# EAGLE design univ_3-rev1 (EAGLE 5.11)
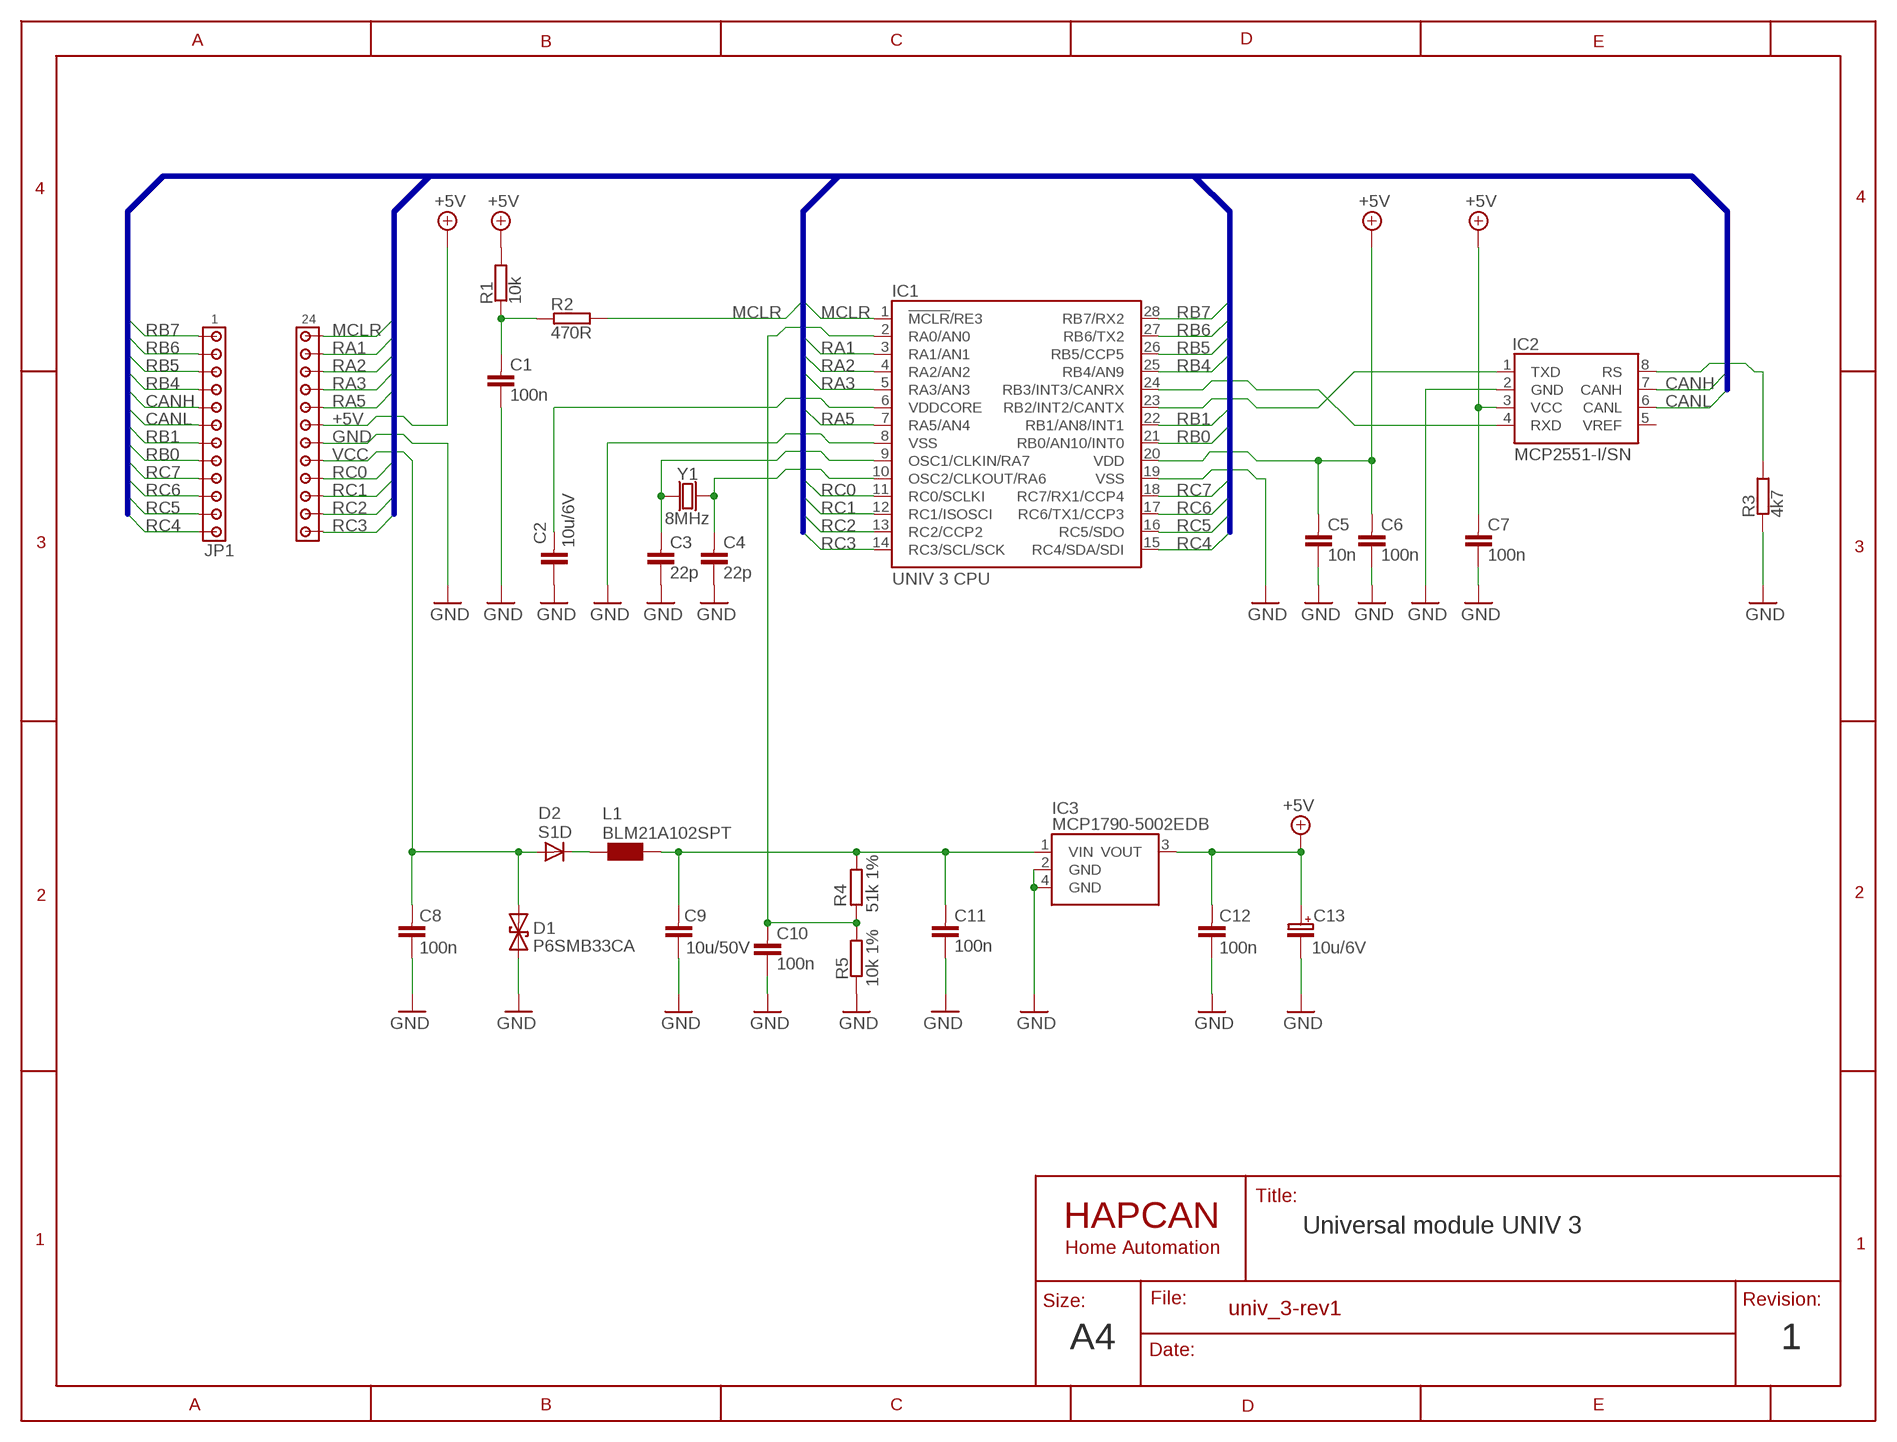
[diagram p0: schematic, sheet 1]

## Parts
C1  100n  CAPACITOR0805  [0805]
C2  10u/6V  CAPACITOR0805  [0805]
C3  22p  CAPACITOR0805  [0805]
C4  22p  CAPACITOR0805  [0805]
C5  10n  CAPACITOR0805  [0805]
C6  100n  CAPACITOR0805  [0805]
C7  100n  CAPACITOR0805  [0805]
C8  100n  CAPACITOR0805  [0805]
C9  10u/50V  CAPACITOR1210  [1210]
C10  100n  CAPACITOR0805  [0805]
C11  100n  CAPACITOR0805  [0805]
C12  100n  CAPACITOR0805  [0805]
C13  10u/6V  CAPACITOR-POLARIZED-SMC_B  [SMC_B]
D1  P6SMB33CA  DIODE_TRANSIL  [DO-214@1]
D2  S1D  DIODEDO-214  [DO-214]
IC1  UNIV 3 CPU  UNIV3(CPU)  [UNIV3CPU]
IC2  MCP2551-I/SN  MCP2551  [SO-08]
IC3  MCP1790-5002EDB  MCP1826SOT223-3  [SOT-223]
JP1  DIL-24  [DIL-24]
L1  BLM21A102SPT  BLMXXX  [0805]
R1  10k  RESISTOR  [0805]
R2  470R  RESISTOR  [0805]
R3  4k7  RESISTOR  [0805]
R4  51k 1%  RESISTOR  [0805]
R5  10k 1%  RESISTOR  [0805]
Y1  8MHz  CRYSTALHC49V  [CRYSTAL-HC49V]

## Nets
+5V: C5.1 C6.1 C7.1 C12.1 C13.+ IC1.20(VDD) IC2.3(VCC) IC3.3(VOUT) JP1.19 R1.2
CANH: IC2.7(CANH) JP1.5
CANL: IC2.6(CANL) JP1.6
GND: C1.2 C2.2 C3.2 C4.2 C5.2 C6.2 C7.2 C8.2 C9.2 C10.2 C11.2 C12.2 C13.- D1.A IC1.8(VSS) IC1.19(VSS) IC2.2(GND) IC3.2(GND) IC3.4(GND) JP1.18 R3.1 R5.1
MCLR: IC1.1(!MCLR!/RE3) JP1.24 R2.2
N$1: C10.1 IC1.2(RA0/AN0) R4.2 R5.2
N$2: IC1.24(RB3/INT3/CANRX) IC2.4(RXD)
N$4: C1.1 R1.1 R2.1
N$8: IC1.23(RB2/INT2/CANTX) IC2.1(TXD)
N$12: IC2.8(RS) R3.2
N$15: C4.1 IC1.10(OSC2/CLKOUT/RA6) Y1.2
N$17: C9.1 C11.1 IC3.1(VIN) L1.1 R4.1
N$40: C3.1 IC1.9(OSC1/CLKIN/RA7) Y1.1
N$56: C2.1 IC1.6(VDDCORE)
N$67: D2.C L1.2
RA1: IC1.3(RA1/AN1) JP1.23
RA2: IC1.4(RA2/AN2) JP1.22
RA3: IC1.5(RA3/AN3) JP1.21
RA5: IC1.7(RA5/AN4) JP1.20
RB0: IC1.21(RB0/AN10/INT0) JP1.8
RB1: IC1.22(RB1/AN8/INT1) JP1.7
RB4: IC1.25(RB4/AN9) JP1.4
RB5: IC1.26(RB5/CCP5) JP1.3
RB6: IC1.27(RB6/TX2) JP1.2
RB7: IC1.28(RB7/RX2) JP1.1
RC0: IC1.11(RC0/SCLKI) JP1.16
RC1: IC1.12(RC1/ISOSCI) JP1.15
RC2: IC1.13(RC2/CCP2) JP1.14
RC3: IC1.14(RC3/SCL/SCK) JP1.13
RC4: IC1.15(RC4/SDA/SDI) JP1.12
RC5: IC1.16(RC5/SDO) JP1.11
RC6: IC1.17(RC6/TX1/CCP3) JP1.10
RC7: IC1.18(RC7/RX1/CCP4) JP1.9
VCC: C8.1 D1.C D2.A JP1.17
Unconnected: IC2.5(VREF)

## Buses
RA[0..5],RB[0..7],RC[0..7],MCLR,CANL,CANH

## Notes on the sheet
- Universal module UNIV 3
- A4 | 1

## Library data of the parts
C1-C12 = HAPCAN_devices - UNIV3:CAPACITOR: HAPCAN Capacitor
C13 = HAPCAN_devices - UNIV3:CAPACITOR-POLARIZED: HAPCAN Polarazied Capacitor
D1 = HAPCAN_devices - UNIV3:DIODE_TRANSIL: Transil diode
D2 = HAPCAN_devices - UNIV3:DIODE: Diode
IC1 = HAPCAN_devices - UNIV3:UNIV3(CPU): HAPCAN Microcontroller UNIV 3 (CPU)
IC2 = HAPCAN_devices - UNIV3:MCP2551: HAPCAN CAN Tranceiver
IC3 = HAPCAN_devices - UNIV3:MCP1826: 1000 mA, Low Voltage, Low Quiescent Current LDO Regulator
JP1 = HAPCAN_devices - UNIV3:DIL-24: HAPCAN DIL-24
L1 = HAPCAN_devices - UNIV3:BLMXXX: Choke
R1-R5 = HAPCAN_devices - UNIV3:RESISTOR: HAPCAN Resistor
Y1 = HAPCAN_devices - UNIV3:CRYSTAL: HAPCAN Crystal

## Board
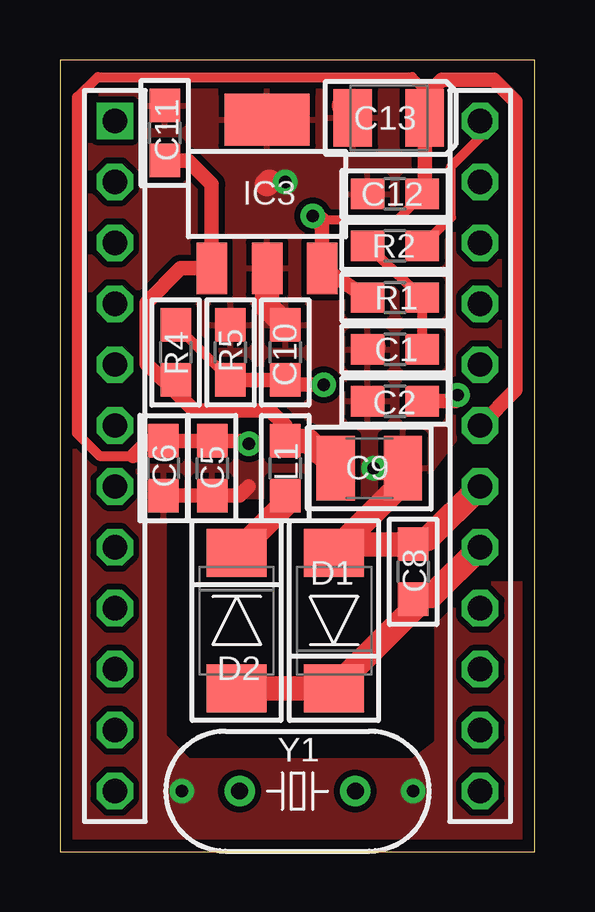
[diagram p1: board, top side]
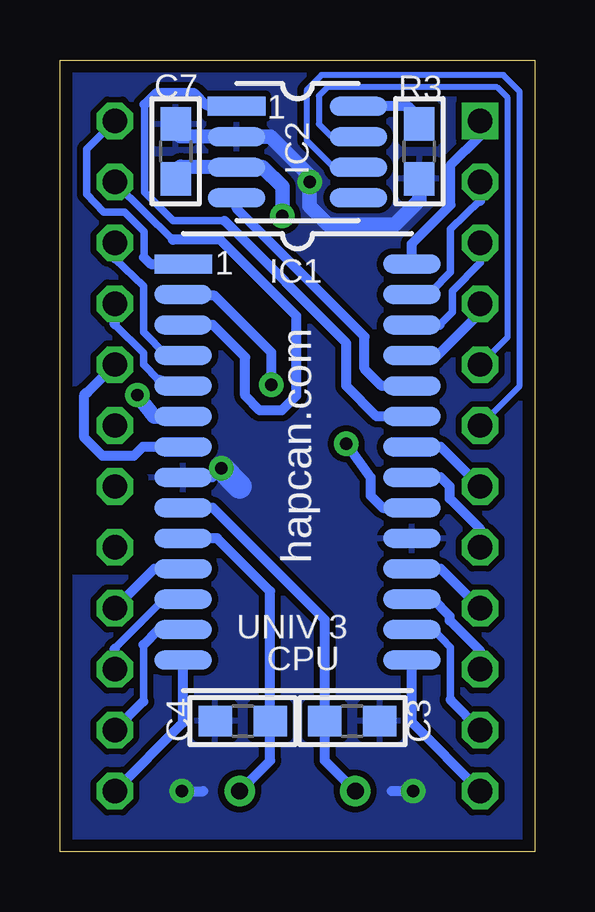
[diagram p2: board, bottom side, seen from below]

Size 19.81 x 33.02 mm. Coordinates in mm from the lower left corner, seen from the top.
Outline: 0,0 19.81,0 19.81,33.02 0,33.02 0,0
Copper layers (1*16): Top 0.035mm / dielectric 1.5mm / Bottom 0.035mm
Design rules "HAPCAN-Drc": minimum track width 10mil, minimum drill 0.5mm, track to track 10mil, track to pad 10mil, pad to pad 10mil, via to via 10mil, smd to smd 0mil, copper to edge 20mil, drill to drill 8mil, minimum pad ring 10mil, minimum via ring 10mil, stop-mask expansion 4mil, vias tented up to drill 0mil, thermal gap 10mil

### Footprints (pad centres in the part's own frame; a part is rotated, then mirrored left to right if it is on the bottom)
0805 = smd 1.397 x 1.27: 1 -1.143,0; 2 1.143,0
1210 = smd 1.6 x 2.7: 1 -1.4,0; 2 1.4,0
SMC_B = smd 1.6 x 2.4: + -1.5,0; - 1.5,0
DO-214@1 = smd 2 x 2.5: A 2.82,0; C -2.82,0
DO-214 = smd 2 x 2.5: A 2.82,0; C -2.82,0
UNIV3CPU = smd 2.4 x 0.8: 1 -4.763,8.255; 2 -4.763,6.985; 3 -4.763,5.715; 4 -4.763,4.445; 5 -4.763,3.175; 6 -4.763,1.905; 7 -4.763,0.635; 8 -4.763,-0.635; 9 -4.763,-1.905; 10 -4.763,-3.175; 11 -4.763,-4.445; 12 -4.763,-5.715; 13 -4.763,-6.985; 14 -4.763,-8.255; 15 4.763,-8.255; 16 4.763,-6.985; 17 4.763,-5.715; 18 4.763,-4.445; 19 4.763,-3.175; 20 4.763,-1.905; 21 4.763,-0.635; 22 4.763,0.635; 23 4.763,1.905; 24 4.763,3.175; 25 4.763,4.445; 26 4.763,5.715; 27 4.763,6.985; 28 4.763,8.255
SO-08 = smd 2.4 x 0.8: 1 -2.54,1.905; 2 -2.54,0.635; 3 -2.54,-0.635; 4 -2.54,-1.905; 5 2.54,-1.905; 6 2.54,-0.635; 7 2.54,0.635; 8 2.54,1.905
SOT-223 = smd 1.27 x 2.159: 1 -2.311,-3.099; 2 0,-3.099; 3 2.311,-3.099 | smd 3.556 x 2.159: 4 0,3.099
DIL-24 = drill 1.016 pad 1.524 square: 1 -7.62,13.97 | drill 1.016 pad 1.524 octagon: 2 -7.62,11.43; 3 -7.62,8.89; 4 -7.62,6.35; 5 -7.62,3.81; 6 -7.62,1.27; 7 -7.62,-1.27; 8 -7.62,-3.81; 9 -7.62,-6.35; 10 -7.62,-8.89; 11 -7.62,-11.43; 12 -7.62,-13.97; 13 7.62,-13.97; 14 7.62,-11.43; 15 7.62,-8.89; 16 7.62,-6.35; 17 7.62,-3.81; 18 7.62,-1.27; 19 7.62,1.27; 20 7.62,3.81; 21 7.62,6.35; 22 7.62,8.89; 23 7.62,11.43; 24 7.62,13.97
CRYSTAL-HC49V = drill 0.7 pad 1.27 round: 1 -2.413,0; 2 2.413,0

### Placement (x,y rotation side)
C1  13.97,20.95 180 top
C2  13.97,18.8 180 top
C3  7.62,5.46 0 bottom
C4  12.19,5.46 180 bottom
C5  6.35,16 270 top
C6  4.32,16 270 top
C7  14.99,29.21 90 bottom
C8  14.73,11.68 90 top
C9  12.9,16 0 top
C10  9.4,20.83 90 top
C11  4.37,29.97 90 top
C12  13.97,27.43 180 top
C13  13.72,30.61 180 top
D1  11.43,9.65 90 top
D2  7.37,9.65 270 top
IC1  9.91,16.26 0 bottom
IC2  9.91,29.18 0 bottom
IC3  8.64,27.43 0 top
JP1  9.91,16.51 0 top
L1  9.4,16 270 top
R1  13.97,23.11 180 top
R2  13.97,25.27 0 top
R3  4.83,29.21 90 bottom
R4  4.83,20.83 90 top
R5  7.11,20.83 270 top
Y1  9.91,2.54 0 top

### Tracks (layer width: path | path; a pad name or v marks a point on that pad's centre or on a via)
+5V  (via drill 0.51 pad 1.02)
  Top 0.381: 14.07,26.35 10.62,26.35
  Top 0.406: C12.1 14.07,26.35 | 10.62,26.35 arc90 v10.54,26.52 10.57,26.52 | 10.92,24.36 IC3.3 | 3.05,16.51 1.65,16.51 0.71,17.45 0.71,31.47 1.57,32.31 14.68,32.31 15.37,31.62
  Top 0.61: C12.1 15.22,28.04 C13.+ 15.37,30.89 15.37,31.62 15.93,32.21 18.09,32.21 19,31.29 19,19.25 JP1.19 | C5.1 C6.1 | 10.92,26.04 10.92,24.36 | IC3.3 12.8,23.11 R1.2 | C5.1 3.68,17.14 3.05,16.51 | C5.1 7.62,17.14 v7.87,17.02 | 10.57,26.52 10.92,26.04 | 10.92,26.04 10.92,26.39 10.97,26.31
  Bottom 0.406: 14.77,28.57 C7.1 | 11.35,28.55 IC2.3 | IC1.20 6.35,14.35 6.86,14.86 6.86,15.62 v7.87,17.02
  Bottom 0.61: IC2.3 14.77,28.57 | 11.35,28.55 10.54,27.74 v10.54,26.52
CANH
  Bottom 0.254: IC2.7 8.51,29.84 9.02,30.35 9.02,31.52 8.66,31.88 1.57,31.88 1.14,31.45 1.14,21.46 JP1.5
CANL
  Bottom 0.254: IC2.6 8.43,28.57 9.53,29.67 9.53,31.75 8.91,32.38 1.32,32.38 0.64,31.7 0.64,19.43 JP1.6
GND  (via drill 0.51 pad 1.02)
  Top 0.61: C6.2 7.49,14.86 7.87,15.24
  Top 1.016: v13.08,16 C9.2 14.02,15.72 14.02,15.11 11.89,12.98 D1.A 11.79,12.83 C8.2 15.33,13.04 JP1.18 | C1.2 13.08,21.04 | 8.64,27.84 8.74,27.94 | C13.- 11.84,31.11 | IC3.2 8.64,22.73 C10.2
  Bottom 0.406: 14.77,29.84 C7.2 | IC1.8 13.46,15.62 v13.08,16 | v5.08,2.54 5.97,2.54 | v14.73,2.54 13.84,2.54
  Bottom 0.61: 14.77,29.84 IC2.2 11.02,29.82 9.4,28.19 9.4,26.92 8.64,26.16 5.84,26.16 4.83,27.18 R3.1
  Bottom 1.016: v13.08,16 12.32,15.24
  other vias: 9.4,27.94
  pour Bottom (isolate 0.254): 0,33.02 19.81,33.02 19.81,16.51 16.76,16.51 16,15.75 16,12.19 16.76,11.43 19.81,11.43 19.81,0 0,0
  pour Top (isolate 0.254): 0,33.02 19.81,33.02 19.81,17.27 16.51,17.27 14.73,14.99 5.33,14.73 4.32,13.72 4.32,4.83 5.33,3.81 14.73,3.81 15.75,4.57 15.75,9.4 17.53,11.18 19.81,11.18 19.81,0 0,0
MCLR
  Top 0.406: R2.2 16.31,26.47 16.31,28.57 17.53,29.8 JP1.24
  Bottom 0.305: 16.31,24.79 16.31,25.86 17.12,26.67 17.98,26.67 18.69,27.43 18.69,29.31 JP1.24
  Bottom 0.406: IC1.1 16.03,24.51 16.31,24.79 | JP1.24
N$1  (via drill 0.51 pad 1.02)
  Top 0.406: v11,19.48 v11,19.47 | R4.2 R5.2 | C10.1 9.6,19.48
  Top 0.61: R5.2 C10.1 | 9.6,19.48 v11,19.48
  Bottom 0.406: v11,19.48 11,20.83 13.36,23.19 14.62,23.19 IC1.2
N$2
  Bottom 0.406: IC1.24 6.4,19.43 7.11,20.14 7.11,21.49 12.45,26.82 IC2.4
N$4
  Top 0.406: C1.1 R1.1 R2.1
N$8
  Bottom 0.305: 12.95,26.31 15.09,26.31 16.28,27.51 16.28,31.17
  Bottom 0.406: 12.65,31.29 IC2.1 12.5,31.14 13.72,31.14 14.22,31.65 15.77,31.65 16.28,31.17 | 12.95,26.31 7.87,21.21 7.87,19.43 6.6,18.16 IC1.23
N$12
  Bottom 0.406: IC2.8 5.28,31.09 4.83,30.66 R3.2
N$15
  Bottom 0.406: IC1.10 13.26,13.08 11.05,10.87 C4.1 11.05,3.81 Y1.2
N$17
  Top 0.406: 9.4,17.78 L1.1
  Top 0.61: 9.4,17.78 8.76,18.41 5.59,18.41 4.57,19.43 | 4.57,19.43 3.61,20.34 3.61,22.91 5.03,24.33 IC3.1 6.33,27.84 5.33,28.83 C11.1 | R4.1 4.57,19.43
  Top 1.016: L1.1 10.36,17.14 C9.1
N$40
  Bottom 0.406: IC1.9 13.44,14.35 8.76,9.68 C3.1 8.76,3.81 Y1.1
N$56  (via drill 0.51 pad 1.02)
  Top 0.61: C2.1 16.51,18.8 v16.59,19.05
  Bottom 0.61: IC1.6 15.88,18.16 v16.59,19.05
N$67
  Top 0.406: 9.4,14.5 L1.2
  Top 1.016: D2.C 9.4,14.5
RA1
  Bottom 0.254: 17.5,27.89 JP1.23
  Bottom 0.305: 15.11,25.53 17.5,27.89
  Bottom 0.406: IC1.3 13.44,21.97 12.09,20.62 12.09,19.02 11.48,18.41 10.57,18.41 9.96,19.02 9.96,22.35 13.13,25.53 15.11,25.53
RA2
  Bottom 0.305: 15.37,20.7 16.33,21.67 16.33,23.6 17.53,24.74
  Bottom 0.406: IC1.4 15.37,20.7 | 17.53,24.74 JP1.22
RA3
  Bottom 0.305: 15.7,19.68 16.33,20.32 16.33,20.8 17.53,22
  Bottom 0.406: IC1.5 15.7,19.68 | JP1.21 17.53,22.02 17.53,22
RA5
  Bottom 0.406: IC1.7 16.36,16.89 16.74,16.51 18.03,16.51 18.8,17.27 18.8,19.02 arc90 18.67,19.15 17.53,20.29 JP1.20
RB0
  Bottom 0.406: JP1.8 2.29,13.21 2.29,13.46 3.56,14.73 3.56,15.24 3.94,15.62 IC1.21
RB1
  Bottom 0.406: IC1.22 3.94,16.89 JP1.7
RB4
  Bottom 0.406: IC1.25 4.06,20.7 2.29,22.48 JP1.4
RB5
  Bottom 0.305: 3.99,21.97 3.45,22.5 3.45,23.39 2.29,24.56 JP1.3
  Bottom 0.406: 3.99,21.97 IC1.26
RB6
  Bottom 0.305: 4.32,23.37 3.53,24.18 3.53,25.96 2.31,27.15 2.29,27.15
  Bottom 0.406: 4.19,23.37 4.32,23.37 5.02,23.37 IC1.27 | JP1.2 2.29,27.16 2.29,27.15
RB7
  Bottom 0.406: IC1.28 5.14,25.36 3.53,26.98 3.53,28.63 2.29,29.87 JP1.1
RC0
  Bottom 0.406: IC1.11 15.88,11.81 JP1.16
RC1
  Bottom 0.305: 17.53,8.48 15.47,10.54
  Bottom 0.406: 15.47,10.54 IC1.12 | JP1.15 17.53,8.48
RC2
  Bottom 0.305: 16.33,6.27 16.33,8.64
  Bottom 0.406: IC1.13 15.7,9.27 16.33,8.64 | 16.33,6.27 JP1.14
RC3
  Bottom 0.406: IC1.14 14.67,5.4 JP1.13
RC4
  Bottom 0.406: IC1.15 5.14,5.4 JP1.12
RC5
  Bottom 0.305: 4.24,9.27 3.53,8.53 3.53,6.35
  Bottom 0.406: 4.24,9.27 IC1.16 | JP1.11 3.53,6.35
RC6
  Bottom 0.406: IC1.17 4.27,10.54 3.56,9.83 3.56,9.65 2.29,8.38 JP1.10
RC7
  Bottom 0.406: IC1.18 3.94,11.81 JP1.9
VCC
  Top 1.016: D2.A D1.C 14.73,10.13 C8.1 14.86,10.67 15.49,10.67 JP1.17

### Text on the board
bPlace: hapcan.com
tValues: 1 | 24 | H | L | hapcan.com | UNIV 3 | pcb rev1 | 12 | 13